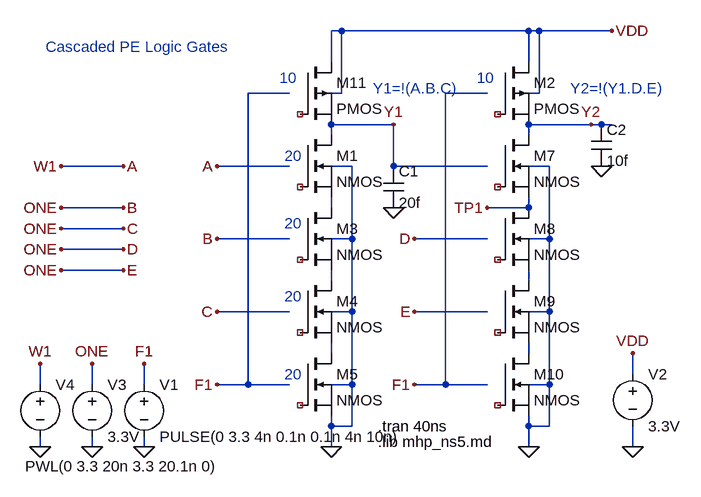
[diagram p0: schematic pe_cascade2.asc]
pe_cascade2.asc, the LTspice schematic file:
Version 4
SHEET 1 1292 680
WIRE -1472 -544 -1488 -544
WIRE -1184 -544 -1472 -544
WIRE -1168 -544 -1184 -544
WIRE -1056 -544 -1168 -544
WIRE -1488 -496 -1488 -544
WIRE -1184 -496 -1184 -544
WIRE -1552 -448 -1616 -448
WIRE -1472 -448 -1472 -544
WIRE -1472 -448 -1488 -448
WIRE -1248 -448 -1312 -448
WIRE -1168 -448 -1168 -544
WIRE -1168 -448 -1184 -448
WIRE -1392 -400 -1488 -400
WIRE -1088 -400 -1184 -400
WIRE -1072 -400 -1088 -400
WIRE -1056 -400 -1072 -400
WIRE -1488 -384 -1488 -400
WIRE -1184 -384 -1184 -400
WIRE -1808 -336 -1904 -336
WIRE -1552 -336 -1664 -336
WIRE -1456 -336 -1488 -336
WIRE -1392 -336 -1392 -400
WIRE -1248 -336 -1392 -336
WIRE -1152 -336 -1184 -336
WIRE -1808 -272 -1904 -272
WIRE -1488 -272 -1488 -288
WIRE -1184 -272 -1184 -288
WIRE -1184 -272 -1248 -272
WIRE -1808 -240 -1904 -240
WIRE -1552 -224 -1664 -224
WIRE -1456 -224 -1456 -336
WIRE -1456 -224 -1488 -224
WIRE -1248 -224 -1360 -224
WIRE -1152 -224 -1152 -336
WIRE -1152 -224 -1184 -224
WIRE -1808 -208 -1904 -208
WIRE -1808 -176 -1904 -176
WIRE -1488 -160 -1488 -176
WIRE -1184 -160 -1184 -176
WIRE -1552 -112 -1664 -112
WIRE -1456 -112 -1456 -224
WIRE -1456 -112 -1488 -112
WIRE -1248 -112 -1360 -112
WIRE -1152 -112 -1152 -224
WIRE -1152 -112 -1184 -112
WIRE -1488 -48 -1488 -64
WIRE -1184 -48 -1184 -64
WIRE -1024 -16 -1024 -48
WIRE -1936 0 -1936 -32
WIRE -1856 0 -1856 -32
WIRE -1776 0 -1776 -32
WIRE -1616 0 -1616 -448
WIRE -1616 0 -1664 0
WIRE -1552 0 -1616 0
WIRE -1456 0 -1456 -112
WIRE -1456 0 -1488 0
WIRE -1312 0 -1312 -448
WIRE -1312 0 -1360 0
WIRE -1248 0 -1312 0
WIRE -1152 0 -1152 -112
WIRE -1152 0 -1184 0
WIRE -1488 64 -1488 48
WIRE -1456 64 -1456 0
WIRE -1456 64 -1488 64
WIRE -1184 64 -1184 48
WIRE -1152 64 -1152 0
WIRE -1152 64 -1184 64
WIRE -1936 96 -1936 80
WIRE -1856 96 -1856 80
WIRE -1776 96 -1776 80
WIRE -1488 96 -1488 64
WIRE -1184 96 -1184 64
WIRE -1024 96 -1024 64
FLAG -1184 96 0
FLAG -1360 0 F1
FLAG -1488 96 0
FLAG -1664 0 F1
FLAG -1024 96 0
FLAG -1776 96 0
FLAG -1024 -48 VDD
FLAG -1776 -32 F1
FLAG -1392 -400 Y1
FLAG -1088 -400 Y2
FLAG -1056 -544 VDD
FLAG -1856 96 0
FLAG -1856 -32 ONE
FLAG -1664 -336 A
FLAG -1664 -224 B
FLAG -1664 -112 C
FLAG -1360 -224 D
FLAG -1360 -112 E
FLAG -1248 -272 TP1
FLAG -1392 -272 0
FLAG -1072 -336 0
FLAG -1808 -272 B
FLAG -1808 -240 C
FLAG -1904 -240 ONE
FLAG -1904 -272 ONE
FLAG -1936 96 0
FLAG -1936 -32 W1
FLAG -1904 -336 W1
FLAG -1808 -336 A
FLAG -1808 -208 D
FLAG -1904 -208 ONE
FLAG -1808 -176 E
FLAG -1904 -176 ONE
SYMBOL pmos -1232 -496 R0
SYMATTR InstName M2
SYMATTR Value2 l=0.6u w=3u
SYMBOL pmos -1536 -496 R0
SYMATTR InstName M11
SYMATTR Value2 l=0.6u w=3u
SYMBOL voltage -1776 -16 R0
WINDOW 123 0 0 Left 2
WINDOW 39 0 0 Left 2
SYMATTR InstName V1
SYMATTR Value PULSE(0 3.3 4n 0.1n 0.1n 4n 10n)
SYMBOL voltage -1024 -32 R0
WINDOW 123 0 0 Left 2
WINDOW 39 0 0 Left 2
SYMATTR InstName V2
SYMATTR Value 3.3V
SYMBOL nmos -1536 -384 R0
SYMATTR InstName M1
SYMATTR SpiceModel ""
SYMATTR Value NMOS
SYMATTR Value2 l=0.6u w=6u
SYMBOL nmos -1536 -272 R0
SYMATTR InstName M3
SYMATTR SpiceModel ""
SYMATTR Value NMOS
SYMATTR Value2 l=0.6u w=6u
SYMBOL nmos -1536 -160 R0
SYMATTR InstName M4
SYMATTR SpiceModel ""
SYMATTR Value NMOS
SYMATTR Value2 l=0.6u w=6u
SYMBOL nmos -1536 -48 R0
SYMATTR InstName M5
SYMATTR SpiceModel ""
SYMATTR Value NMOS
SYMATTR Value2 l=0.6u w=6u
SYMBOL nmos -1232 -384 R0
SYMATTR InstName M7
SYMATTR SpiceModel ""
SYMATTR Value NMOS
SYMATTR Value2 l=0.6u w=6u
SYMBOL nmos -1232 -272 R0
SYMATTR InstName M8
SYMATTR SpiceModel ""
SYMATTR Value NMOS
SYMATTR Value2 l=0.6u w=6u
SYMBOL nmos -1232 -160 R0
SYMATTR InstName M9
SYMATTR SpiceModel ""
SYMATTR Value NMOS
SYMATTR Value2 l=0.6u w=6u
SYMBOL nmos -1232 -48 R0
SYMATTR InstName M10
SYMATTR SpiceModel ""
SYMATTR Value NMOS
SYMATTR Value2 l=0.6u w=6u
SYMBOL voltage -1856 -16 R0
WINDOW 123 0 0 Left 2
WINDOW 39 0 0 Left 2
SYMATTR InstName V3
SYMATTR Value 3.3V
SYMBOL cap -1408 -336 R0
SYMATTR InstName C1
SYMATTR Value 20f
SYMBOL cap -1088 -400 R0
SYMATTR InstName C2
SYMATTR Value 10f
SYMBOL voltage -1936 -16 R0
WINDOW 123 0 0 Left 2
WINDOW 39 0 0 Left 2
WINDOW 3 -23 142 Left 2
SYMATTR InstName V4
SYMATTR Value PWL(0 3.3 20n 3.3 20.1n 0)
TEXT -1264 -472 Left 2 ;10
TEXT -1568 -472 Left 2 ;10
TEXT -1416 88 Left 2 !.lib mhp_ns5.md
TEXT -1416 64 Left 2 !.tran 40ns
TEXT -1928 -520 Left 2 ;Cascaded PE Logic Gates
TEXT -1560 -352 Left 2 ;20
TEXT -1560 -248 Left 2 ;20
TEXT -1560 -136 Left 2 ;20
TEXT -1560 -16 Left 2 ;20
TEXT -1424 -456 Left 2 ;Y1=!(A.B.C)
TEXT -1120 -456 Left 2 ;Y2=!(Y1.D.E)

The netlist it stands for:
* pe_cascade2.asc
* M2: PMOS l=0.6u w=3u (symbol pmos not certain, pin order unknown); nets seen at it: VDD, Y2
* M11: PMOS l=0.6u w=3u (symbol pmos not certain, pin order unknown); nets seen at it: VDD, Y1
V1 F1 0 PULSE(0 3.3 4n 0.1n 0.1n 4n 10n)
V2 VDD 0 3.3V
* M1: NMOS l=0.6u w=6u (symbol nmos not certain, pin order unknown); nets seen at it: N001, Y1
* M3: NMOS l=0.6u w=6u (symbol nmos not certain, pin order unknown); nets seen at it: N001, N002
* M4: NMOS l=0.6u w=6u (symbol nmos not certain, pin order unknown); nets seen at it: N002, N004
* M5: NMOS l=0.6u w=6u (symbol nmos not certain, pin order unknown); nets seen at it: 0, N004
* M7: NMOS l=0.6u w=6u (symbol nmos not certain, pin order unknown); nets seen at it: TP1, Y2
* M8: NMOS l=0.6u w=6u (symbol nmos not certain, pin order unknown); nets seen at it: N003, TP1
* M9: NMOS l=0.6u w=6u (symbol nmos not certain, pin order unknown); nets seen at it: N003, N005
* M10: NMOS l=0.6u w=6u (symbol nmos not certain, pin order unknown); nets seen at it: 0, N005
V3 E 0 3.3V
C1 Y1 0 20f
C2 Y2 0 10f
V4 W1 0 PWL(0 3.3 20n 3.3 20.1n 0)
* 10
* 10
.lib mhp_ns5.md
.tran 40ns
* Cascaded PE Logic Gates
* 20
* 20
* 20
* 20
* Y1=!(A.B.C)
* Y2=!(Y1.D.E)
.backanno
.end